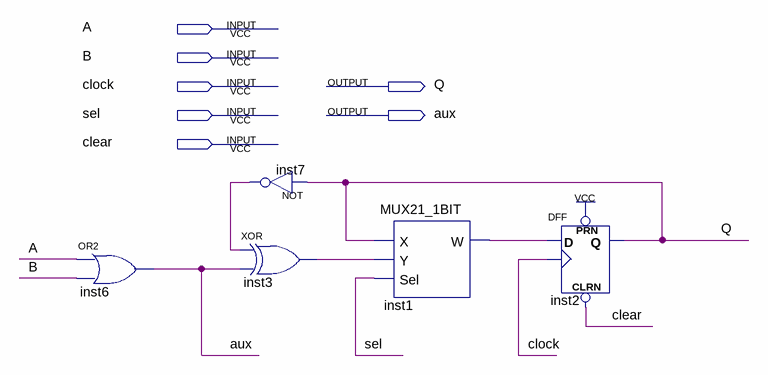
[diagram p0: schematic sheet]
// Quartus schematic AuxSubtrator.bdf as structural Verilog: 5 symbols, 7 pins
module AuxSubtrator (
  input  A,
  input  B,
  input  clock,
  input  sel,
  input  clear,
  output Q,
  output aux
);

  wire inst1_w, inst3_out, inst7_out;

  or inst6 (aux, A, B);
  not inst7 (inst7_out, Q);
  xor inst3 (inst3_out, inst7_out, aux);
  MUX21_1BIT inst1 (.X(Q), .Y(inst3_out), .Sel(sel), .W(inst1_w));
  DFF inst2 (.CLRN(clear), .CLK(clock), .D(inst1_w), .PRN(1'b1), .Q(Q));
endmodule
